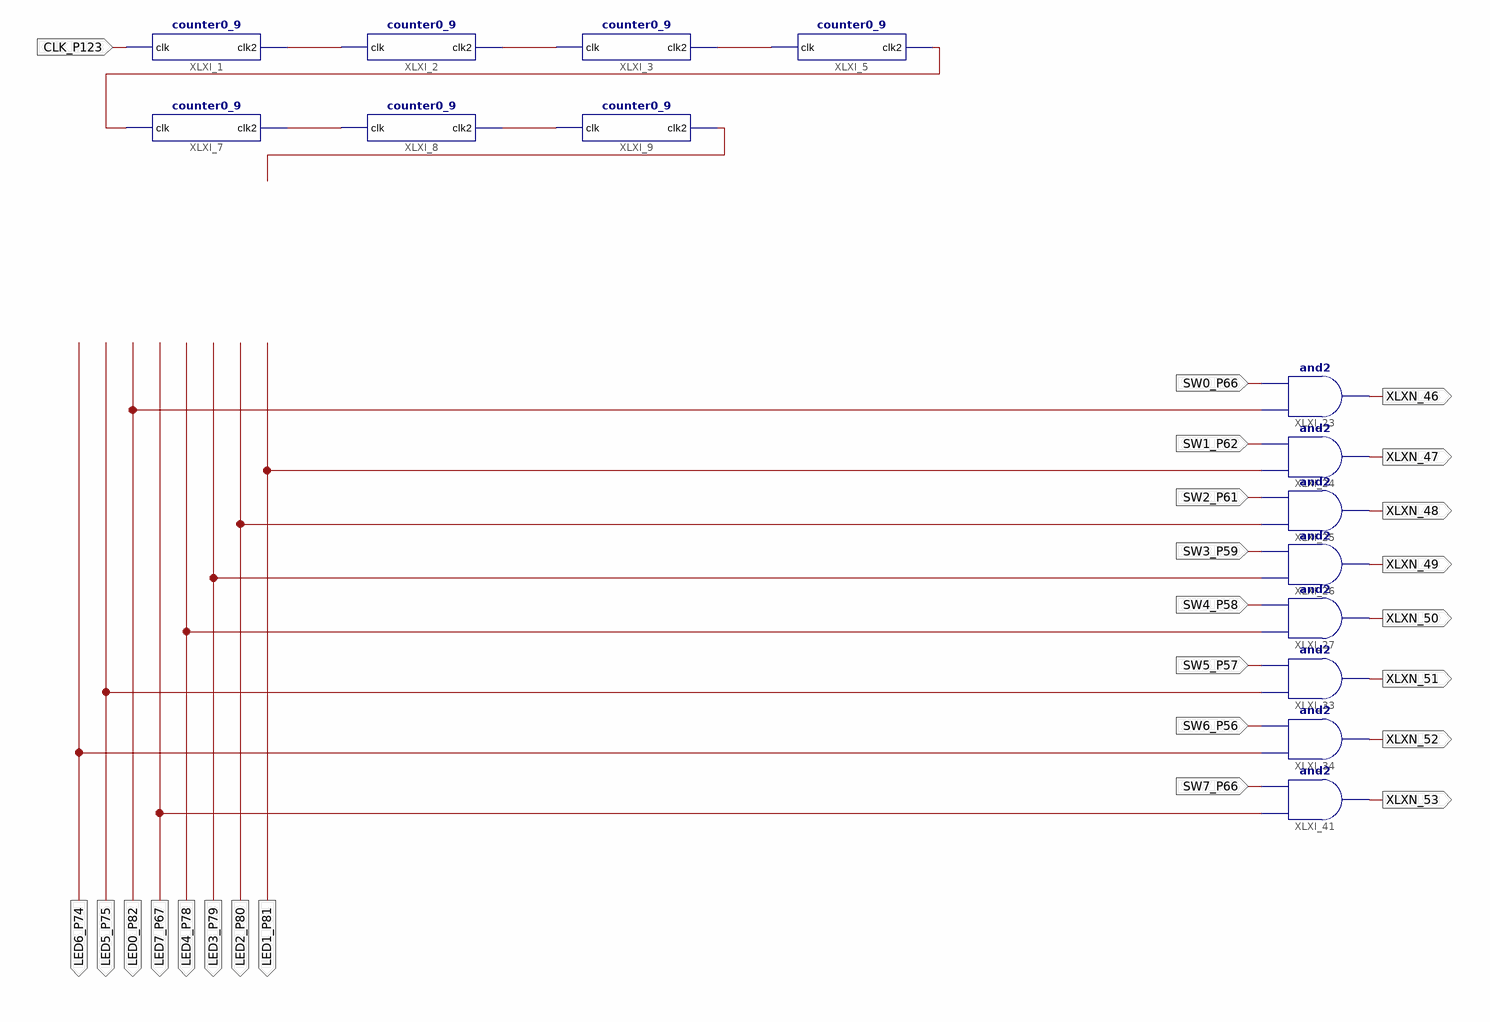
[diagram p0: schematic sheet 1]
// Xilinx ISE schematic sch_6.sch (spartan6) as structural Verilog: 15 symbols, 25 ports
module sch_6 (
  input  CLK_P123,
  input  SW0_P66,
  input  SW1_P62,
  input  SW2_P61,
  input  SW3_P59,
  input  SW4_P58,
  input  SW5_P57,
  input  SW6_P56,
  input  SW7_P66,
  output LED6_P74,
  output LED5_P75,
  output LED0_P82,
  output LED7_P67,
  output LED4_P78,
  output LED3_P79,
  output LED2_P80,
  output LED1_P81,
  output XLXN_46,
  output XLXN_47,
  output XLXN_48,
  output XLXN_49,
  output XLXN_50,
  output XLXN_51,
  output XLXN_52,
  output XLXN_53
);

  wire P82, XLXN_1, XLXN_2, XLXN_3, XLXN_4, XLXN_5, XLXN_6;

  counter0_9 XLXI_1 (.clk(CLK_P123), .clk2(XLXN_1));
  counter0_9 XLXI_2 (.clk(XLXN_1), .clk2(XLXN_2));
  counter0_9 XLXI_3 (.clk(XLXN_2), .clk2(XLXN_3));
  counter0_9 XLXI_7 (.clk(XLXN_4), .clk2(XLXN_5));
  counter0_9 XLXI_8 (.clk(XLXN_5), .clk2(XLXN_6));
  counter0_9 XLXI_9 (.clk(XLXN_6), .clk2(P82));
  counter0_9 XLXI_5 (.clk(XLXN_3), .clk2(XLXN_4));
  and XLXI_23 (XLXN_46, LED0_P82, SW0_P66);
  and XLXI_24 (XLXN_47, LED1_P81, SW1_P62);
  and XLXI_25 (XLXN_48, LED2_P80, SW2_P61);
  and XLXI_26 (XLXN_49, LED3_P79, SW3_P59);
  and XLXI_27 (XLXN_50, LED4_P78, SW4_P58);
  and XLXI_33 (XLXN_51, LED5_P75, SW5_P57);
  and XLXI_34 (XLXN_52, LED6_P74, SW6_P56);
  and XLXI_41 (XLXN_53, LED7_P67, SW7_P66);
endmodule
